# EAGLE design motor_4mm (EAGLE 5.10)
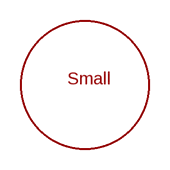
[diagram p0: schematic, sheet 1]

## Parts
GND  SLOT_SM  [SLOT_SM]

## Library data of the parts
GND = NSL_MiniQuad:SLOT_SM

## Board
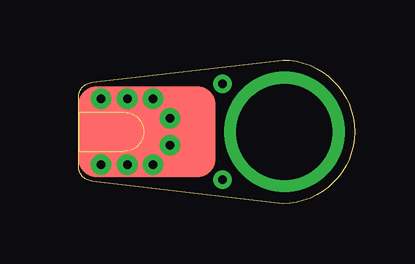
[diagram p1: board, top side]
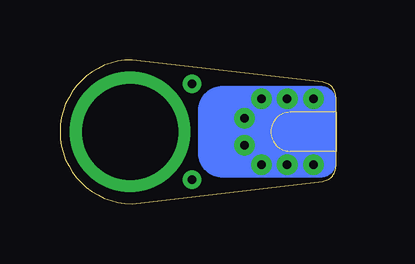
[diagram p2: board, bottom side, seen from below]

Size 11.5 x 6 mm. Coordinates in mm from the lower left corner, seen from the top.
Outline: 8.5,6 arc-180 8.5,0 0.56,0.93 arc-83 0,1.56 0,4.44 arc-83 0.56,5.07 8.5,6
Copper layers (1*16): Top 0.035mm / dielectric 1.5mm / Bottom 0.035mm
Design rules "default": minimum track width 10mil, minimum drill 24mil, track to track 8mil, track to pad 8mil, pad to pad 8mil, via to via 8mil, smd to smd 8mil, copper to edge 40mil, drill to drill 8mil, minimum pad ring 10mil, minimum via ring 8mil, stop-mask expansion 4mil, vias tented up to drill 0mil, thermal gap 10mil

### Footprints (pad centres in the part's own frame; a part is rotated, then mirrored left to right if it is on the bottom)
SLOT_SM = drill 0.356 round: M 0.94,1.372; N 2.032,1.372; O 3.099,1.372; P 3.81,0.559; Q 0.94,-1.372; R 2.032,-1.372; S 3.099,-1.372; T 3.81,-0.559 | smd 5.715 x 3.81: P$1 2.845,0

### Placement (x,y rotation side)
GND  0,3 0 top

### Tracks (layer width: path | path; a pad name or v marks a point on that pad's centre or on a via)
GND  (via drill 4)
  other vias: 8.58,3
N$3  (via drill 0.36)
  other vias: 6,5
N$5  (via drill 0.36)
  other vias: 6,1